# Altium project RT-701_V005.PrjPcb
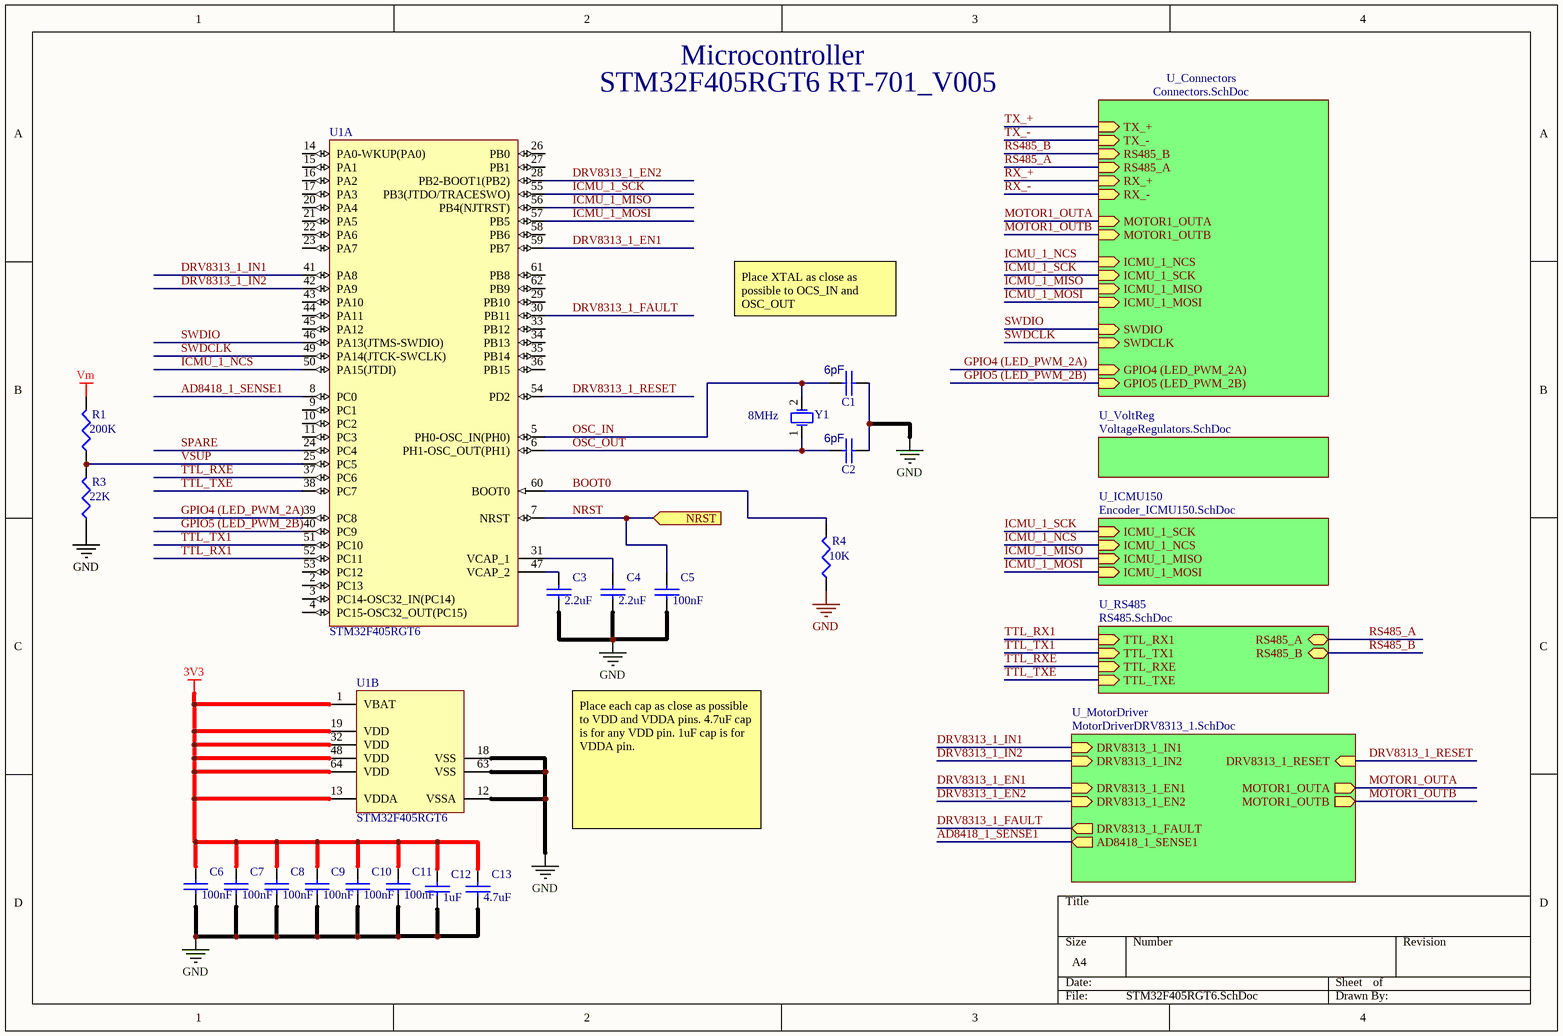
[diagram p0: STM32F405RGT6.SchDoc]
6 sheets, 76 parts. Net scope: hierarchical (ports join the sheet entries above them; power ports are global).
Board file: RT-701_V005.PcbDoc
Sheets:
  STM32F405RGT6.SchDoc
    U_RS485 = RS485.SchDoc
    U_MotorDriver = MotorDriverDRV8313_1.SchDoc
    U_ICMU150 = Encoder_ICMU150.SchDoc
    U_VoltReg = VoltageRegulators.SchDoc
    U_Connectors = Connectors.SchDoc

## Sheet STM32F405RGT6.SchDoc
size A4

### Parts
C1  Capacitance: 6pF  [CAP0402]  (hidden comment: Capacitor)
C2  Capacitance: 6pF  [CAP0402]  (hidden comment: Capacitor)
C3  value 2.2uF  [CAP0402]  (hidden comment: Capacitor)
C4  value 2.2uF  [CAP0402]  (hidden comment: Capacitor)
C5  value 100nF  [CAP0402]  (hidden comment: Capacitor)
C6  value 100nF  [CAP0402]  (hidden comment: Capacitor)
C7  value 100nF  [CAP0402]  (hidden comment: Capacitor)
C8  value 100nF  [CAP0402]  (hidden comment: Capacitor)
C9  value 100nF  [CAP0402]  (hidden comment: Capacitor)
C10  value 100nF  [CAP0402]  (hidden comment: Capacitor)
C11  value 100nF  [CAP0402]  (hidden comment: Capacitor)
C12  value 1uF  [CAP0402]  (hidden comment: Capacitor)
C13  value 4.7uF  [CAP0402]  (hidden comment: Capacitor)
R1  value 200K  [RES0402]  (hidden comment: Res)
R3  value 22K  [RES0402]  (hidden comment: Res)
R4  value 10K  [RES0402]  (hidden comment: Res)
U1  STM32F405RGT6  [STM-LQFP64_N]  (parts A,B of 2)
Y1  value 8MHz  [2-SMD-XTAL (3.2x2.5)]  (hidden comment: Osc)

### Sub-sheets
U_Connectors = Connectors.SchDoc: TX_+ (in), RS485_B (in), RX_+ (in), MOTOR1_OUTA (in), MOTOR1_OUTB (in), TX_- (in), RS485_A (in), RX_- (in), ICMU_1_NCS (in), ICMU_1_SCK (in), ICMU_1_MISO (in), ICMU_1_MOSI (in), SWDIO (in), SWDCLK (in), GPIO4 (LED_PWM_2A) (in), GPIO5 (LED_PWM_2B) (in)
U_ICMU150 = Encoder_ICMU150.SchDoc: ICMU_1_SCK (in), ICMU_1_NCS (in), ICMU_1_MISO (in), ICMU_1_MOSI (in)
U_MotorDriver = MotorDriverDRV8313_1.SchDoc: DRV8313_1_IN1 (in), DRV8313_1_IN2 (in), DRV8313_1_EN1 (in), DRV8313_1_EN2 (in), MOTOR1_OUTA (out), MOTOR1_OUTB (out), DRV8313_1_RESET (in), DRV8313_1_FAULT (out), AD8418_1_SENSE1 (out)
U_RS485 = RS485.SchDoc: TTL_RX1 (in), TTL_TX1 (in), TTL_RXE (in), TTL_TXE (in), RS485_A (bidir), RS485_B (bidir)
U_VoltReg = VoltageRegulators.SchDoc: no entries

### Ports
NRST (in)

### Nets
3V3: C6.1 C7.1 C8.1 C9.1 C10.1 C11.1 C12.1 C13.1 U1.1(VBAT) U1.13(VDDA) U1.19(VDD) U1.32(VDD) U1.48(VDD) U1.64(VDD)
GND: C1.1 C2.1 C3.2 C4.2 C5.2 C6.2 C7.2 C8.2 C9.2 C10.2 C11.2 C12.2 C13.2 R3.1 R4.1 U1.12(VSSA) U1.18(VSS) U1.63(VSS)
Vm: R1.2
AD8418_1_SENSE1: U1.8(PC0) ; sheet U_MotorDriver/AD8418_1_SENSE1
BOOT0: R4.2 U1.60(BOOT0)
DRV8313_1_EN1: U1.59(PB7) ; sheet U_MotorDriver/DRV8313_1_EN1
DRV8313_1_EN2: U1.28(PB2-BOOT1(PB2)) ; sheet U_MotorDriver/DRV8313_1_EN2
DRV8313_1_FAULT: U1.30(PB11) ; sheet U_MotorDriver/DRV8313_1_FAULT
DRV8313_1_IN1: U1.41(PA8) ; sheet U_MotorDriver/DRV8313_1_IN1
DRV8313_1_IN2: U1.42(PA9) ; sheet U_MotorDriver/DRV8313_1_IN2
DRV8313_1_RESET: U1.54(PD2) ; sheet U_MotorDriver/DRV8313_1_RESET
GPIO4 (LED_PWM_2A): U1.39(PC8) ; sheet U_Connectors/GPIO4 (LED_PWM_2A)
GPIO5 (LED_PWM_2B): U1.40(PC9) ; sheet U_Connectors/GPIO5 (LED_PWM_2B)
ICMU_1_MISO: U1.56(PB4(NJTRST)) ; sheet U_ICMU150/ICMU_1_MISO, sheet U_Connectors/ICMU_1_MISO
ICMU_1_MOSI: U1.57(PB5) ; sheet U_ICMU150/ICMU_1_MOSI, sheet U_Connectors/ICMU_1_MOSI
ICMU_1_NCS: U1.50(PA15(JTDI)) ; sheet U_ICMU150/ICMU_1_NCS, sheet U_Connectors/ICMU_1_NCS
ICMU_1_SCK: U1.55(PB3(JTDO/TRACESWO)) ; sheet U_ICMU150/ICMU_1_SCK, sheet U_Connectors/ICMU_1_SCK
MOTOR1_OUTA: sheet U_MotorDriver/MOTOR1_OUTA, sheet U_Connectors/MOTOR1_OUTA
MOTOR1_OUTB: sheet U_MotorDriver/MOTOR1_OUTB, sheet U_Connectors/MOTOR1_OUTB
NRST: C5.1 U1.7(NRST) ; port NRST
OSC_IN: C1.2 U1.5(PH0-OSC_IN(PH0)) Y1.2
OSC_OUT: C2.2 U1.6(PH1-OSC_OUT(PH1)) Y1.1
RS485_A: sheet U_RS485/RS485_A, sheet U_Connectors/RS485_A
RS485_B: sheet U_RS485/RS485_B, sheet U_Connectors/RS485_B
SPARE: U1.24(PC4)
SWDCLK: U1.49(PA14(JTCK-SWCLK)) ; sheet U_Connectors/SWDCLK
SWDIO: U1.46(PA13(JTMS-SWDIO)) ; sheet U_Connectors/SWDIO
TTL_RX1: U1.52(PC11) ; sheet U_RS485/TTL_RX1
TTL_RXE: U1.37(PC6) ; sheet U_RS485/TTL_RXE
TTL_TX1: U1.51(PC10) ; sheet U_RS485/TTL_TX1
TTL_TXE: U1.38(PC7) ; sheet U_RS485/TTL_TXE
VSUP: R1.1 R3.2 U1.25(PC5)
NetC3_1: C3.1 U1.47(VCAP_2)
NetC4_1: C4.1 U1.31(VCAP_1)

Not connected (* = marked no-connect by the designer): U1 2(PC13) 3(PC14-OSC32_IN(PC14)) 4(PC15-OSC32_OUT(PC15)) 9(PC1) 10(PC2) 11(PC3) 14(PA0-WKUP(PA0)) 15(PA1) 16(PA2) 17(PA3) 20(PA4) 21(PA5) 22(PA6) 23(PA7) 26(PB0) 27(PB1) 29(PB10) 33(PB12) 34(PB13) 35(PB14) 36(PB15) 43(PA10) 44(PA11) 45(PA12) 53(PC12) 58(PB6) 61(PB8) 62(PB9)

### Notes on the sheet
- STM32F405RGT6 RT-701_V005
- Microcontroller
- Place XTAL as close as possible to OCS_IN and OSC_OUT
- Place each cap as close as possible to VDD and VDDA pins. 4.7uF cap is for any VDD pin. 1uF cap is for VDDA pin.

### Library data of the parts
C1 C2 = Capacitor: CAP CER 6PF 100V C0G/NP0 0402; Manufacturer 1: KEMET; Manufacturer Part Number 1: CBR04C609B1GAC; Manufacturer: *; Manufacturer Part Number: *; Supplier: *; Supplier Part Number: *; Tolerance: *; Voltage: *; Footprint: *; Temperature Coefficient: *; Supplier 1: Digi-Key; Supplier Part Number 1: 399-8610-1-ND; RoHS: Yes; Category: Ceramic Capacitors; Stock 1: 20446; Pricing 1: 1=0,34000, 10=0,23300, 50=0,15540, 100=0,13200, 500=0,09320, 1000=0,08154, 2500=0,07766, 5000=0,07184 (USD); Mount: Surface Mount; Case/Package: 0402; Case Code (Metric): 1005; Case Code (Imperial): 0402; Min Operating Temperature: -55°C; Max Operating Temperature: 125°C; Package Quantity: 1; Voltage Rating: 100V; Packaging: Tape and Reel; Voltage Rating (DC): 100V; Series: CBR; Length: 0.039inch; Width: 0.02inch; Thickness: 0.022inch; RoHS Compliant: Yes; ComponentLink1URL: https://datasheet.ciiva.com/6257/kem-c1030-cbr-smd-6257478.pdf?src-supplier=Digi-Key; ComponentLink1Description: https://datasheet.ciiva.com/6257/kem-c1030-cbr-smd-6257478.pdf?src-supplier=Digi-Key; ComponentLink2URL: https://datasheet.ciiva.com/6257/kem-c1030-cbr-smd-6257482.pdf?src-supplier=Digi-Key; ComponentLink2Description: https://datasheet.ciiva.com/6257/kem-c1030-cbr-smd-6257482.pdf?src-supplier=Digi-Key
C3 C4 = Capacitor: Manufacturer: TDK Corporation; Manufacturer Part Number: C1005X5R0J225K050BC; Tolerance: 10%; Voltage: 6.3V; Temperature Coefficient: X5R; Supplier: Digikey; Supplier Part Number: 445-6847-1-ND; Footprint: 0402; Component Type: Capacitor Ceramic
C5-C11 = Capacitor: Manufacturer: TDK Corporation; Manufacturer Part Number: CGA2B3X7R1V104K050BB; Tolerance: 10%; Voltage: 35V; Temperature Coefficient: X7R; Supplier: Digi-Key; Supplier Part Number: 445-6901-1-ND; Footprint: 0201 (0603 Metric); Component Type: Capacitor Ceramic; Price: 0.21
C12 = Capacitor: Manufacturer: TDK Corporation; Manufacturer Part Number: C1005X5R1V105K050BC; Tolerance: 10%; Voltage: 35V; Temperature Coefficient: X5R; Supplier: Digikey; Supplier Part Number: 445-9073-1-ND; Footprint: 0201 (0603 Metric); Component Type: Capacitor Ceramic
C13 = Capacitor: Manufacturer: TDK Corporation; Manufacturer Part Number: C1005X5R0J475K050BC; Tolerance: 10%; Voltage: 6.3V; Supplier: Digikey; Supplier Part Number: 445-5947-1-ND; Footprint: 0201 (0603 Metric); Component Type: Capacitor Ceramic; Price: 0.6
R1 = Resistor: Manufacturer: Yageo; Manufacturer Part Number: RC0402FR-07200KL; Power Rating: 0.063W; Tolerance: 1%; Component Type: Resistor; Price: 0.14; Supplier: Digi-Key; Supplier Part Number: 311-200KLRCT-ND; Footprint: 0201 (0603 Metric)
R3 = Resistor: Manufacturer: Yageo; Manufacturer Part Number: RC0402FR-0722KL; Power Rating: 0.063W; Tolerance: 1%; Component Type: Resistor; Price: 0.14; Supplier: Digikey; Supplier Part Number: 311-22.0KLRCT-ND
R4 = Resistor: Manufacturer: Yageo; Manufacturer Part Number: RC0402FR-0710KL; Power Rating: 0.063W; Tolerance: 1%; Component Type: Resistor; Price: 0.14; Supplier: Digi-Key; Supplier Part Number: 311-10.0KLRCT-ND; Footprint: 0201 (0603 Metric)
U1 = STM32F405RGT6: ARM Cortex-M4 32-bit MCU+FPU, 210 DMIPS, 1024 kB Flash, 192 kB Internal RAM, 51 I/Os, 64-pin LQFP, -40 to 85 degC, Tray; Manufacturer: STMicroelectronics; Component Type: ARM® Cortex®-M4 STM32 F4 Microcontroller IC 32-Bit 168MHz 1MB (1M x 8) FLASH 64-LQFP (10x10); Manufacturer Part Number: STM32F405RGT6; Price: 14.74; Supplier: Digi-Key; Supplier Part Number: 497-11767-ND
Y1 = Crystal Oscillator: Manufacturer: NDK; Manufacturer Part Number: NX3225GD-8MHZ-STD-CRA-3; Component Type: Crystal Oscillator; Price: 0.94; Supplier: Digi-Key; Supplier Part Number: 644-1178-1-ND

## Sheet RS485.SchDoc
size A4
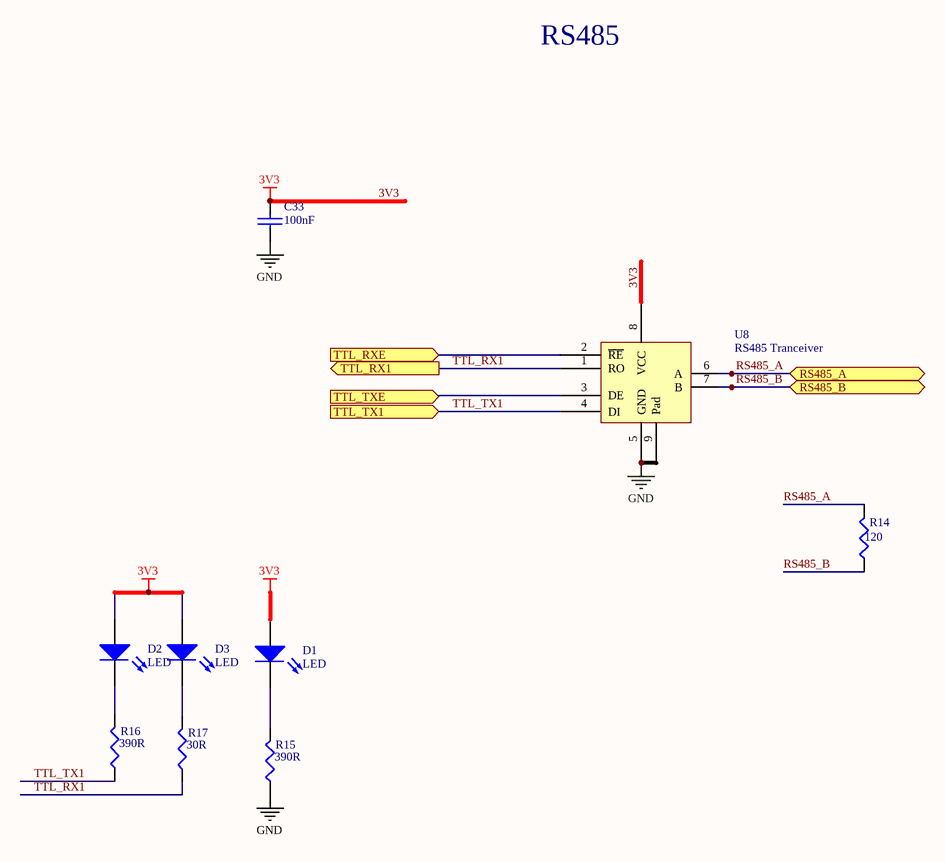
[diagram p1: RS485.SchDoc]

### Parts
C33  value 100nF  [CAP0402]  (hidden comment: Capacitor)
D1  LED  [LED-0603-RED]
D2  LED  [LED-0603-YELLOW]
D3  LED  [LED-0603-GREEN]
R14  value 120  [RES1206]  (hidden comment: Res)
R15  value 390R  [RES0402]  (hidden comment: Res)
R16  value 390R  [RES0402]  (hidden comment: Res)
R17  value 30R  [RES0402]  (hidden comment: Res)
U8  RS485 Tranceiver  [MAX22501EATA+]

### Ports
RS485_A (bidir), RS485_B (bidir), TTL_RX1 (out), TTL_RXE (in), TTL_TX1 (in), TTL_TXE (in)

### Nets
3V3: C33.1 D1.2 D2.2 D3.2 U8.8(VCC)
GND: C33.2 R15.1 U8.5(GND) U8.9(Pad)
RS485_A: R14.2 U8.6(A) ; port RS485_A
RS485_B: R14.1 U8.7(B) ; port RS485_B
TTL_RX1: R17.1 U8.1(RO) ; port TTL_RX1
TTL_RXE: U8.2(~{RE}) ; port TTL_RXE
TTL_TX1: R16.1 U8.4(DI) ; port TTL_TX1
TTL_TXE: U8.3(DE) ; port TTL_TXE
NetD1_1: D1.1 R15.2
NetD2_1: D2.1 R16.2
NetD3_1: D3.1 R17.2

### Notes on the sheet
- RS485

### Library data of the parts
C33 = Capacitor: as C5 on sheet STM32F405RGT6; Supplier: Digi-Key; Supplier Part Number: 445-6901-1-ND; Footprint: 0402 (1005 Metric); Component Type: Capacitor Ceramic; Price: 0.21
D1 = LED: Manufacturer: Wurth Electronics Inc.; Manufacturer Part Number: 150060RS75000; Colour: Red; Component Type: Red 625nm LED Indication - Discrete 2V 0603 (1608 Metric); Price: 0.39; Supplier: Digi-Key; Supplier Part Number: 732-4978-1-ND
D2 = LED: Manufacturer: Wurth Electronics Inc.; Manufacturer Part Number: 150060YS75000; Colour: Yellow; Component Type: Yellow 590nm LED Indication - Discrete 2V 0603 (1608 Metric); Price: 0.39; Supplier: Digi-Key; Supplier Part Number: 732-4981-1-ND
D3 = LED: Manufacturer: Wurth Electronics Inc.; Manufacturer Part Number: 150060GS75000; Colour: Green; Component Type: Green 520nm LED Indication - Discrete 3.2V 0603 (1608 Metric); Price: 0.39; Supplier: Digi-Key; Supplier Part Number: 732-4971-1-ND
R14 = Resistor: Component Type: Resistor
R15 R16 = Resistor: Manufacturer: Yageo; Manufacturer Part Number: RC0402FR-07390RL; Power Rating: 0.063W; Tolerance: 1%; Component Type: Resistor; Price: 0.14; Supplier: Digi-Key; Supplier Part Number: 311-390LRCT-ND; Footprint: 0201 (0603 Metric)
R17 = Resistor: Manufacturer: Yageo; Manufacturer Part Number: RC0402FR-0730RL; Power Rating: 0.063W; Tolerance: 1%; Component Type: Resistor; Price: 0.14; Supplier: Digi-Key; Supplier Part Number: 311-30LRCT-ND; Footprint: 0201 (0603 Metric)
U8 = MAX22501EATA+: Manufacturer: Maxim Integrated; Price: 2.91; Supplier Part Number: MAX22501EATA+-ND; Manufacturer Part Number: MAX22501EATA+; Component Type: 1/1 Transceiver Half RS422, RS485 8-TDFN (3x3); Supplier: Digi-Key

## Sheet MotorDriverDRV8313_1.SchDoc
size A4
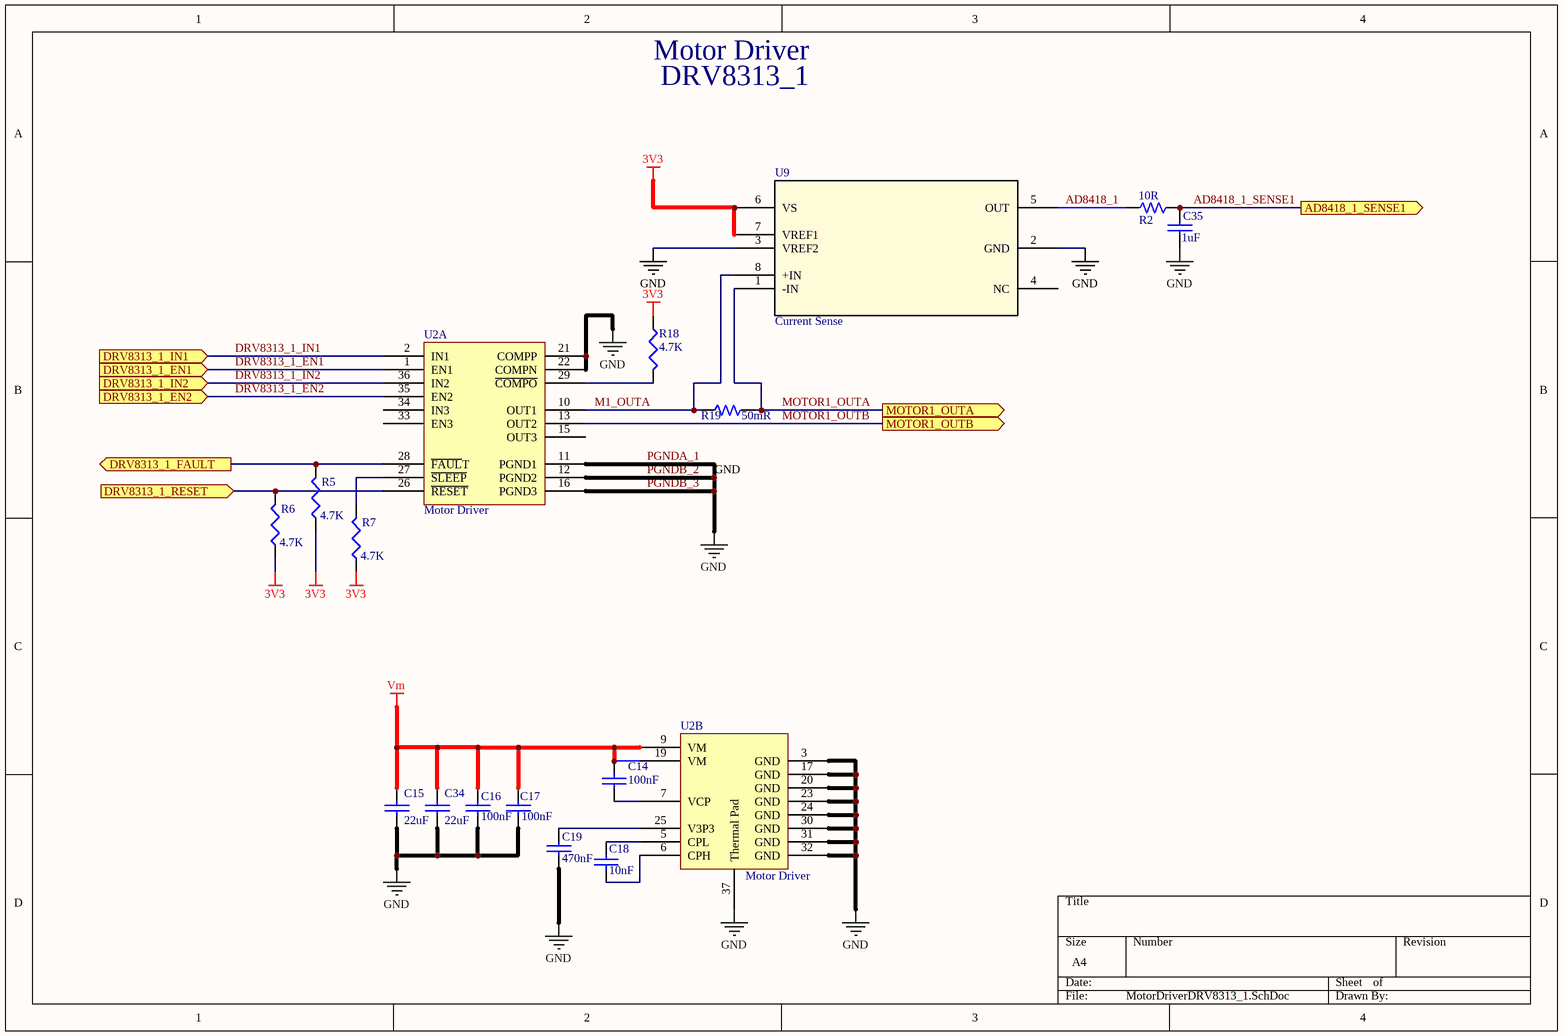
[diagram p2: MotorDriverDRV8313_1.SchDoc]

### Parts
C14  value 100nF  [CAP0402]  (hidden comment: Capacitor)
C15  value 22uF  [CAP0805]  (hidden comment: Capacitor)
C16  value 100nF  [CAP0402]  (hidden comment: Capacitor)
C17  value 100nF  [CAP0402]  (hidden comment: Capacitor)
C18  value 10nF  [CAP0402]  (hidden comment: Capacitor)
C19  value 470nF  [CAP0402]  (hidden comment: Capacitor)
C34  value 22uF  [CAP0805]  (hidden comment: Capacitor)
C35  value 1uF  [CAP0402]  (hidden comment: Capacitor)
R2  Resistance: 10R  [RES0402]  (hidden comment: Resistor)
R5  value 4.7K  [RES0402]  (hidden comment: Res)
R6  value 4.7K  [RES0402]  (hidden comment: Res)
R7  value 4.7K  [RES0402]  (hidden comment: Res)
R18  value 4.7K  [RES0402]  (hidden comment: Res)
R19  Resistance: 50mR  [RES0805]  (hidden comment: Resistor)
U2  Motor Driver  [DRV8313RHHR]  (parts A,B of 2)
U9  Current Sense  [AD8418BRMZ]

### Ports
AD8418_1_SENSE1 (out), DRV8313_1_EN1 (in), DRV8313_1_EN2 (in), DRV8313_1_FAULT (out), DRV8313_1_IN1 (in), DRV8313_1_IN2 (in), DRV8313_1_RESET (in), MOTOR1_OUTA (out), MOTOR1_OUTB (out)

### Nets
3V3: R5.1 R6.1 R7.1 R18.1 U9.6(VS) U9.7(VREF1)
GND: C15.2 C16.2 C17.2 C19.2 C34.2 C35.2 U2.3(GND) U2.11(PGND1) U2.12(PGND2) U2.16(PGND3) U2.17(GND) U2.20(GND) U2.21(COMPP) U2.22(COMPN) U2.23(GND) U2.24(GND) U2.30(GND) U2.31(GND) U2.32(GND) U2.37(Thermal_Pad) U9.2(GND) U9.3(VREF2)  [also labelled PGNDA_1, PGNDB_2, PGNDB_3]
Vm: C14.1 C15.1 C16.1 C17.1 C34.1 U2.9(VM) U2.19(VM)
AD8418_1: R2.1 U9.5(OUT)
AD8418_1_SENSE1: C35.1 R2.2 ; port AD8418_1_SENSE1
DRV8313_1_EN1: U2.1(EN1) ; port DRV8313_1_EN1
DRV8313_1_EN2: U2.35(EN2) ; port DRV8313_1_EN2
DRV8313_1_FAULT: R5.2 U2.28(~{FAUL}T) ; port DRV8313_1_FAULT
DRV8313_1_IN1: U2.2(IN1) ; port DRV8313_1_IN1
DRV8313_1_IN2: U2.36(IN2) ; port DRV8313_1_IN2
DRV8313_1_RESET: R6.2 U2.26(~{RESET}) ; port DRV8313_1_RESET
M1_OUTA: R19.1 U2.10(OUT1) U9.8(+IN)
MOTOR1_OUTA: R19.2 U9.1(-IN) ; port MOTOR1_OUTA
MOTOR1_OUTB: U2.13(OUT2) ; port MOTOR1_OUTB
NetC14_2: C14.2 U2.7(VCP)
NetC18_1: C18.1 U2.5(CPL)
NetC18_2: C18.2 U2.6(CPH)
NetC19_1: C19.1 U2.25(V3P3)
NetR7_2: R7.2 U2.27(~{SLEEP})
NetR18_2: R18.2 U2.29(~{COMPO})

Not connected (* = marked no-connect by the designer): U2 15(OUT3) 33(EN3) 34(IN3); U9 4(NC)

### Notes on the sheet
- Motor Driver
- DRV8313_1

### Library data of the parts
C14 C16 C17 = Capacitor: as C5 on sheet STM32F405RGT6; Supplier: Digi-Key; Supplier Part Number: 445-6901-1-ND; Footprint: 0201 (0603 Metric); Component Type: Capacitor Ceramic; Price: 0.21
C15 C34 = Capacitor: Manufacturer: TDK Corporation; Manufacturer Part Number: C2012JB1V226M125AC; Tolerance: 20%; Voltage: 35V; Supplier: Digikey; Supplier Part Number: 445-11527-1-ND; Footprint: 0805; Component Type: Capacitor Ceramic; Price: 1.49
C18 = Capacitor: Manufacturer: TDK Corporation; Manufacturer Part Number: C1005X7R1V103K050BB; Tolerance: 10%; Voltage: 35V; Temperature Coefficient: X7R; Supplier: Digi-Key; Supplier Part Number: 445-7338-1-ND; Footprint: 0201 (0603 Metric); Component Type: Capacitor Ceramic; Price: 0.14
C19 = Capacitor: Manufacturer: Murata Electronics North America; Manufacturer Part Number: GRM155R61A474KE15D; Tolerance: 10%; Voltage: 10V; Temperature Coefficient: X5R; Supplier: Digi-Key; Supplier Part Number: 490-3264-1-ND; Footprint: 0201 (0603 Metric); Component Type: Capacitor Ceramic; Price: 0.140
C35 = Capacitor: as C12 on sheet STM32F405RGT6; Supplier: Digikey; Supplier Part Number: 445-9073-1-ND; Footprint: 0402 (1005 Metric); Component Type: Capacitor Ceramic
R2 = Resistor: Manufacturer 1: Panasonic; Manufacturer Part Number 1: ERJ-2RKF10R0X; Voltage Rating (DC): 50V; Max Power Dissipation: 100mW; Tolerance: 1%; Temperature Coefficient: 100ppm/°C; Supplier 1: Digi-Key; Supplier Part Number 1: P10.0LCT-ND; Stock 1: 6121248; Pricing 1: 1=0,10000, 10=0,04800, 100=0,01960, 1000=0,00882, 2500=0,00766, 5000=0,00633 (USD); RoHS: Yes; Mount: Surface Mount; Case/Package: 0402; Number of Pins: 2; Case Code (Imperial): 0402; Case Code (Metric): 1005; Contact Plating: Tin; Min Operating Temperature: -55°C; Max Operating Temperature: 155°C; Features: Automotive AEC-Q200; Power Rating: 100mW; Termination: SMD/SMT; Composition: Thick Film; Voltage Rating: 50V; Number of Terminations: 2; Packaging: Tape and Reel; Military Standard: Not; Package Quantity: 1; Length: 1mm; Height: 0.35mm; Depth: 0.5mm; Width: 0.5mm; Radiation Hardening: No; Lead Free: Lead Free; REACH SVHC: No SVHC; ComponentLink1URL: https://datasheet.ciiva.com/11821/0900766b80f80784-11821168.pdf?src-supplier=RSComponents; ComponentLink1Description: https://datasheet.ciiva.com/11821/0900766b80f80784-11821168.pdf?src-supplier=RSComponents; ComponentLink2URL: https://datasheet.ciiva.com/7802/aoa0000ce2-7802405.pdf?src-supplier=Element14; ComponentLink2Description: https://datasheet.ciiva.com/7802/aoa0000ce2-7802405.pdf?src-supplier=Element14; ComponentLink3URL: https://datasheet.ciiva.com/43467/1678782-43467127.pdf?src-supplier=Farnell; ComponentLink3Description: https://datasheet.ciiva.com/43467/1678782-43467127.pdf?src-supplier=Farnell; ComponentLink4URL: https://datasheet.ciiva.com/22668/1678782-22668302.pdf?src-supplier=Element14; ComponentLink4Description: https://datasheet.ciiva.com/22668/1678782-22668302.pdf?src-supplier=Element14; ComponentLink5URL: https://datasheet.ciiva.com/16773/70260748-16773366.pdf?src-supplier=Allied+Electronics; ComponentLink5Description: https://datasheet.ciiva.com/16773/70260748-16773366.pdf?src-supplier=Allied+Electronics; ComponentLink6URL: https://datasheet.ciiva.com/9194/aoa0000ce2-9194120.pdf?src-supplier=Avnet; ComponentLink6Description: https://datasheet.ciiva.com/9194/aoa0000ce2-9194120.pdf?src-supplier=Avnet; ComponentLink7URL: https://datasheet.ciiva.com/30218/aoa0000ce2-30218536.pdf?src-supplier=Onlinecomponents.com; ComponentLink7Description: https://datasheet.ciiva.com/30218/aoa0000ce2-30218536.pdf?src-supplier=Onlinecomponents.com; ComponentLink8URL: https://datasheet.ciiva.com/17212/aoa0000ce2-17212057.pdf?src-supplier=Avnet+Europe; ComponentLink8Description: https://datasheet.ciiva.com/17212/aoa0000ce2-17212057.pdf?src-supplier=Avnet+Europe; ComponentLink9URL: https://datasheet.ciiva.com/24071/aoa0000ce2-24071514.pdf?src-supplier=Mouser; ComponentLink9Description: https://datasheet.ciiva.com/24071/aoa0000ce2-24071514.pdf?src-supplier=Mouser; ComponentLink10URL: https://datasheet.ciiva.com/27055/1987054-27055644.pdf?src-supplier=Jameco; ComponentLink10Description: https://datasheet.ciiva.com/27055/1987054-27055644.pdf?src-supplier=Jameco; ComponentLink11URL: https://datasheet.ciiva.com/6082/aoa0000ce2-6082046.pdf?src-supplier=Farnell; ComponentLink11Description: https://datasheet.ciiva.com/6082/aoa0000ce2-6082046.pdf?src-supplier=Farnell
R5-R7 R18 = Resistor: Manufacturer: Yageo; Manufacturer Part Number: RC0402JR-074K7L; Power Rating: 0.063W; Tolerance: 5%; Component Type: Resistor; Price: 0.14; Supplier: Digikey; Supplier Part Number: 311-4.7KJRCT-ND; Footprint: 0402
R19 = Resistor: Manufacturer 1: Bourns; Manufacturer Part Number 1: CRM0805-FW-R050ELF; Power Rating: 250mW; Tolerance: 1%; Voltage Rating: 477mV; Temperature Coefficient: 200ppm/°C; Supplier 1: Digi-Key; Supplier Part Number 1: CRM0805-FW-R050ELFCT-ND; Stock 1: 43412; Pricing 1: 1=0,65000, 10=0,48200, 25=0,39120, 50=0,34020, 100=0,28070, 250=0,24384, 500=0,19846, 1000=0,15741 (USD); RoHS: Yes; Case/Package: 0805; Number of Pins: 2; Case Code (Imperial): 0805; Case Code (Metric): 2012; Min Operating Temperature: -55°C; Max Operating Temperature: 155°C; Composition: Thick Film; Number of Terminations: 2; Packaging: Tape and Reel; Package Quantity: 1; Max Power Dissipation: 250mW; Length: 0.079inch; Height: 0.024inch; Width: 0.047inch; REACH SVHC: No SVHC; ComponentLink1URL: https://datasheet.ciiva.com/22693/1859481-22693285.pdf?src-supplier=Element14; ComponentLink1Description: https://datasheet.ciiva.com/22693/1859481-22693285.pdf?src-supplier=Element14; ComponentLink2URL: https://datasheet.ciiva.com/6564/crm0805-1206-2010-6564006.pdf?src-supplier=Digi-Key; ComponentLink2Description: https://datasheet.ciiva.com/6564/crm0805-1206-2010-6564006.pdf?src-supplier=Digi-Key; ComponentLink3URL: https://datasheet.ciiva.com/6564/crm0805-1206-2010-6564007.pdf?src-supplier=Digi-Key; ComponentLink3Description: https://datasheet.ciiva.com/6564/crm0805-1206-2010-6564007.pdf?src-supplier=Digi-Key; ComponentLink4URL: https://datasheet.ciiva.com/6564/crm0805-1206-2010-6564008.pdf?src-supplier=Digi-Key; ComponentLink4Description: https://datasheet.ciiva.com/6564/crm0805-1206-2010-6564008.pdf?src-supplier=Digi-Key; ComponentLink5URL: https://datasheet.ciiva.com/7985/1859481-7985934.pdf?src-supplier=Element14; ComponentLink5Description: https://datasheet.ciiva.com/7985/1859481-7985934.pdf?src-supplier=Element14
U2 = DRV8313RHHR: 2.5A 3-phase BLDC controller; Manufacturer: Texas Instruments; Component Type: Motor Driver Power MOSFET; Manufacturer Part Number: DRV8313RHHR; Price: 5.08; Supplier: Digi-Key; Supplier Part Number: 296-44591-1-ND
U9 = AD8418BRMZ: Imported; Manufacturer: Analog Devices Inc; Component Type: Current Sense Amplifier 1 Circuit 8-MSOP; Manufacturer Part Number: AD8418BRMZ; Supplier: Digi-Key; Supplier Part Number: AD8418BRMZ-ND; Price: 3.50

## Sheet Encoder_ICMU150.SchDoc
size A4
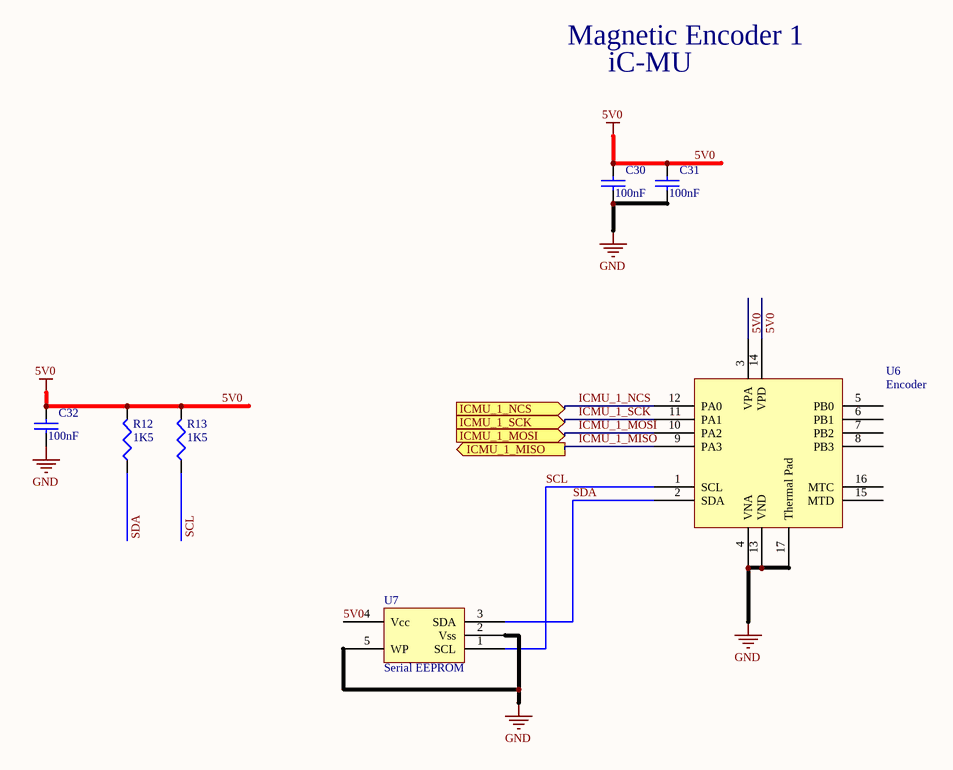
[diagram p3: Encoder_ICMU150.SchDoc]

### Parts
C30  value 100nF  [CAP0402]  (hidden comment: Capacitor)
C31  value 100nF  [CAP0402]  (hidden comment: Capacitor)
C32  value 100nF  [CAP0402]  (hidden comment: Capacitor)
R12  value 1K5  [RES0402]  (hidden comment: Res)
R13  value 1K5  [RES0402]  (hidden comment: Res)
U6  Encoder  [iC-MU RevC2]
U7  Serial EEPROM  [SOT23-5]

### Ports
ICMU_1_MISO (out), ICMU_1_MOSI (in), ICMU_1_NCS (in), ICMU_1_SCK (in)

### Nets
5V0: C30.1 C31.1 C32.1 R12.2 R13.2 U6.3(VPA) U6.14(VPD) U7.4(Vcc)
GND: C30.2 C31.2 C32.2 U6.4(VNA) U6.13(VND) U6.17(Thermal_Pad) U7.2(Vss) U7.5(WP)
ICMU_1_MISO: U6.9(PA3) ; port ICMU_1_MISO
ICMU_1_MOSI: U6.10(PA2) ; port ICMU_1_MOSI
ICMU_1_NCS: U6.12(PA0) ; port ICMU_1_NCS
ICMU_1_SCK: U6.11(PA1) ; port ICMU_1_SCK
SCL: R13.1 U6.1(SCL) U7.1(SCL)
SDA: R12.1 U6.2(SDA) U7.3(SDA)

Not connected (* = marked no-connect by the designer): U6 5(PB0) 6(PB1) 7(PB2) 8(PB3) 15(MTD) 16(MTC)

### Notes on the sheet
- Magnetic Encoder 1
- iC-MU

### Library data of the parts
C30-C32 = Capacitor: Manufacturer: TDK Corporation; Manufacturer Part Number: CGA2B3X7R1V104K050BB; Voltage: 35V; Supplier: Digi-Key; Supplier Part Number: 445-6901-1-ND; Tolerance: *; Footprint: 0402; Component Type: Capacitor Ceramic
R12 R13 = Resistor: Manufacturer: Yageo; Manufacturer Part Number: RC0402FR-071K5L; Component Type: Resistor; Supplier: Digi-Key; Supplier Part Number: 311-1.50KLRCT-ND; Power Rating: *; Footprint: 0402; Tolerance: *
U6 = IC-MU DFN16-5x5: Off Axis Encoder with Hall Sensors; Manufacturer: iC-Haus; Manufacturer Part Number: IC-MU150DFN16-5X5; Component Type: Magnetic Off-Axis Absolute Position Encoder - pole width 1.50 mm; Supplier: Symmetry Electronics; Supplier Part Number: IC-MU150DFN16-5X5
U7 = 24AA02T-I/OT: 2K I2C Serial EEPROM; Manufacturer: Microchip Technology; Footprint: SOT-23-5; Price: 0.28; Supplier: Digi-Key; Supplier Part Number: 24AA02T-I/OTCT-ND; Component Type: IC EEPROM 2KBIT 400KHZ SOT23-5; Manufacturer Part Number: 24AA02T-I/OT

## Sheet VoltageRegulators.SchDoc
size A4
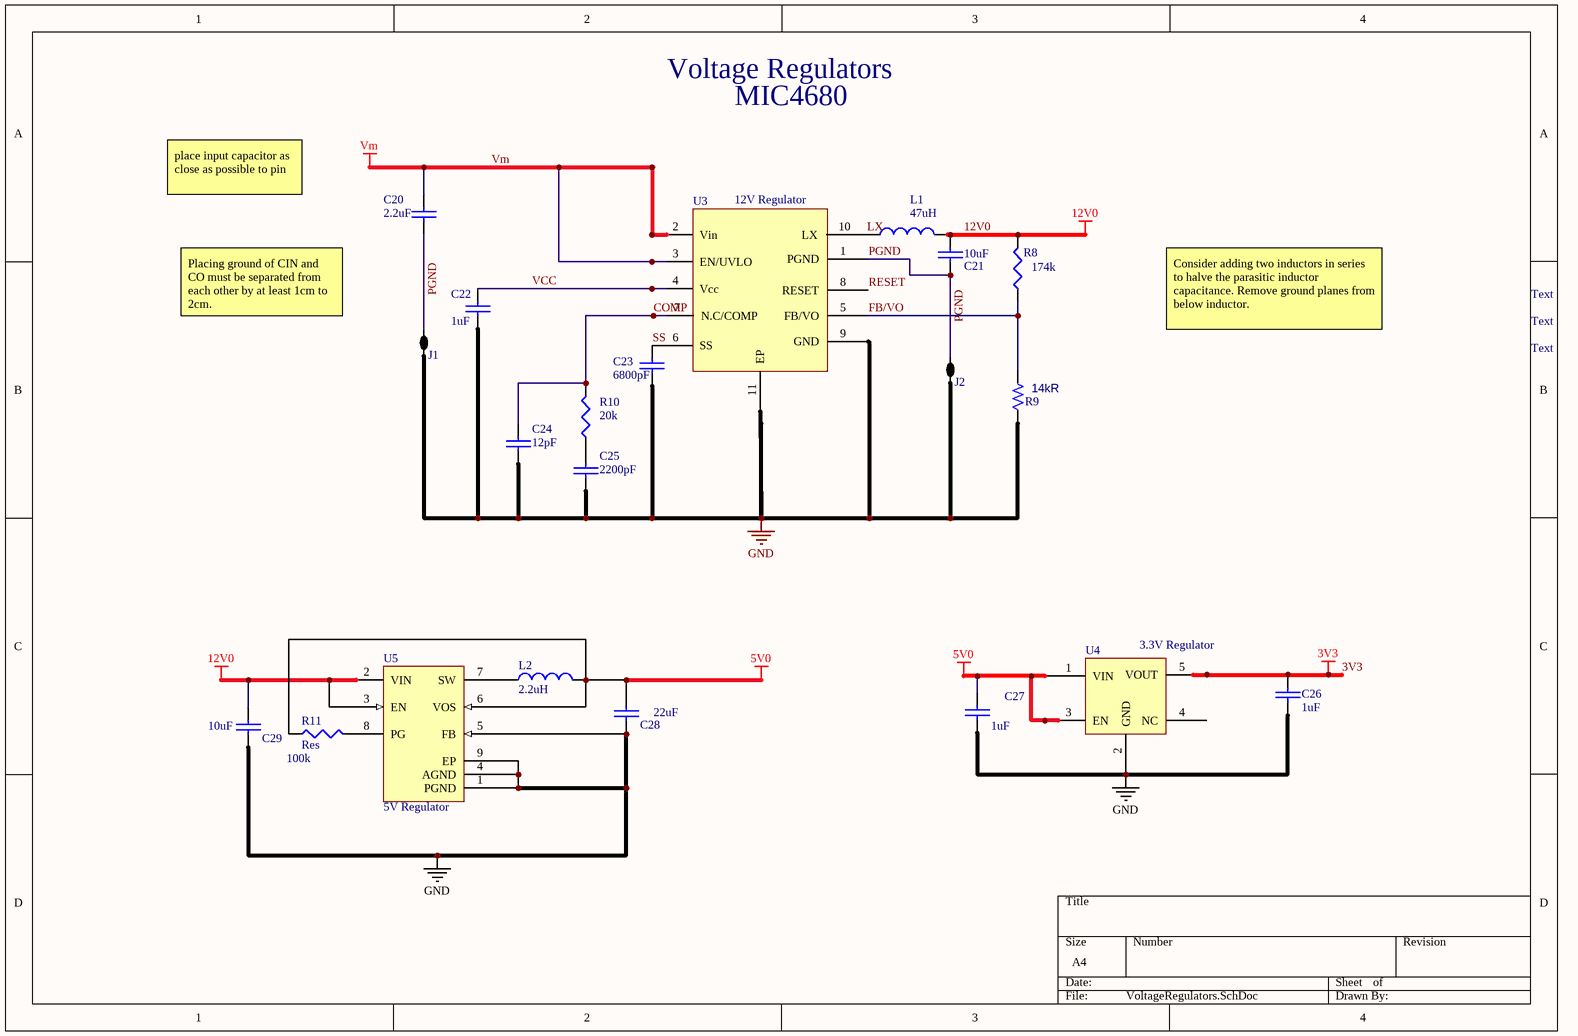
[diagram p4: VoltageRegulators.SchDoc]

### Parts
C20  value 2.2uF  [CAP0805]  (hidden comment: Capacitor)
C21  value 10uF  [CAP1210]  (hidden comment: Capacitor)
C22  value 1uF  [CAP0402]  (hidden comment: Capacitor)
C23  value 6800pF  [CAP0402]  (hidden comment: Capacitor)
C24  value 12pF  [CAP0402]  (hidden comment: Capacitor)
C25  value 2200pF  [CAP0402]  (hidden comment: Capacitor)
C26  value 1uF  [CAP0402]  (hidden comment: Capacitor)
C27  value 1uF  [CAP0402]  (hidden comment: Capacitor)
C28  value 22uF  [CAP0805]  (hidden comment: Capacitor)
C29  value 10uF  [CAP0805]  (hidden comment: Capacitor)
J1  2 way net tie junction  [2way_LP]  (value not drawn)  (net tie, no BOM)
J2  2 way net tie junction  [2way_LP]  (value not drawn)  (net tie, no BOM)
L1  value 47uH  [74404064470]  (hidden comment: Inductor)
L2  value 2.2uH  [VLS3012HBX]  (hidden comment: Inductor)
R8  value 174k  [RES0402]  (hidden comment: Res)
R9  Resistance: 14kR  [RES0402]  (hidden comment: Resistor)
R10  value 20k  [RES0402]  (hidden comment: Res)
R11  Res  value 100k  [RES0402]
U3  12V Regulator  [L10 3x2 0.5mm Pitch]
U4  3.3V Regulator  [SOT23-5]
U5  5V Regulator  [DSG8-1600X900TP]

### Nets
3V3: C26.1 U4.5(VOUT)
5V0: C27.1 C28.1 L2.2 R11.1 U4.1(VIN) U4.3(EN) U5.6(VOS)
12V0: C21.1 C29.1 L1.2 R8.2 U5.2(VIN) U5.3(EN)
GND: C22.2 C23.2 C24.2 C25.2 C26.2 C27.2 C28.2 C29.2 J1.1 J2.1 R9.1 U3.9(GND) U3.11(EP) U4.2(GND) U5.1(PGND) U5.4(AGND) U5.5(FB) U5.9(EP)
Vm: C20.1 U3.2(Vin) U3.3(EN/UVLO)
COMP: C24.1 R10.2 U3.7(N.C/COMP)
FB/VO: R8.1 R9.2 U3.5(FB/VO)
LX: L1.1 U3.10(LX)
PGND: C20.2 C21.2 J1.2 J2.2 U3.1(PGND)
RESET: U3.8(RESET)
SS: C23.1 U3.6(SS)
VCC: C22.1 U3.4(Vcc)
NetC25_1: C25.1 R10.1
NetL2_1: L2.1 U5.7(SW)
NetR11_2: R11.2 U5.8(PG)

Not connected (* = marked no-connect by the designer): U4 4(NC)

### Notes on the sheet
- Voltage Regulators
- MIC4680
- place input capacitor as close as possible to pin
- Placing ground of CIN and CO must be separated from each other by at least 1cm to 2cm.
- Text
- Consider adding two inductors in series to halve the parasitic inductor capacitance. Remove ground planes from below inductor.

### Library data of the parts
C20 = Capacitor: Manufacturer: TDK Corporation; Manufacturer Part Number: C2012X7R1V225K085AC; Tolerance: 10%; Voltage: 35V; Temperature Coefficient: X7R; Supplier: Digikey; Supplier Part Number: 445-14547-1-ND; Footprint: 0805; Component Type: Capacitor Ceramic
C21 = Capacitor: Manufacturer: KEMET; Manufacturer Part Number: C1210C106K9RAC7800; Tolerance: 10%; Voltage: 6.3V; Temperature Coefficient: X7R; Supplier: Digikey; Supplier Part Number: 399-13220-1-ND; Footprint: 1210; Component Type: Capacitor Ceramic; Price: 1.39
C22 C26 C27 = Capacitor: as C12 on sheet STM32F405RGT6; Supplier: Digikey; Component Type: Capacitor Ceramic
  C22: Supplier Part Number: 445-9073-1-ND; Footprint: 0201
  C26 C27: Supplier Part Number: 1276-6795-1-ND; Footprint: 0201 (0603 Metric)
C23 = Capacitor: Manufacturer: KEMET; Manufacturer Part Number: C0402C682J5RACTU; Tolerance: 10%; Voltage: 50V; Temperature Coefficient: X7R; Supplier: Digi-Key; Supplier Part Number: 399-8975-1-ND; Footprint: 0402; Component Type: Capacitor Ceramic; Price: 0.13
C24 = Capacitor: Manufacturer: KEMET; Manufacturer Part Number: C0402C120J3GACAUTO; Tolerance: 5%; Voltage: 25; Supplier: digikey; Supplier Part Number: 399-6829-1-ND; Footprint: 0402; Component Type: Capacitor Ceramic; Price: 0.41; Temperature Coefficient: *
C25 = Capacitor: Manufacturer: Murata Electronics North America; Manufacturer Part Number: GRM155R71H222KA01D; Tolerance: 10%; Voltage: 50V; Temperature Coefficient: X7R; Supplier: Digi-Key; Supplier Part Number: 490-1305-1-ND; Footprint: 0402; Component Type: Capacitor Ceramic; Price: 0.14
C28 = Capacitor: Manufacturer: TDK Corporation; Manufacturer Part Number: C2012X5R0J226K125AB; Tolerance: 10%; Voltage: 6.3V; Temperature Coefficient: X5R; Supplier: Digikey; Supplier Part Number: 445-7679-1-ND; Footprint: 0805; Component Type: Ceramic Capacitor; Price: .99
C29 = Capacitor: Manufacturer: Murata Electronics North America; Manufacturer Part Number: GRM21BR61E106MA73L; Tolerance: 10%; Voltage: 25V; Temperature Coefficient: X5R; Supplier: Digikey; Supplier Part Number: 490-10748-1-ND; Footprint: 0805; Component Type: Ceramic Capacitor; Price: .29
J1 J2 = 2way: ComponentLink1URL: http://www.edatools.cz/addons; ComponentLink1Description: Source; FootprintNote: LP=12mil, MP=40mil, HP=120mil
L1 = Inductor: FIXED IND 47UH 1.2A 200 MOHM SMD; Manufacturer: Wurth Electronics Inc.; Component Type: Inductor; Manufacturer Part Number: 74404064470; Price: 1.63; Supplier: Digi-Key; Supplier Part Number: 732-5556-1-ND; ESR: *; Saturation Current: *
L2 = Inductor: FIXED IND 2.2UH 3.15A 106 MOHM; Manufacturer: TDK Corporation; Manufacturer Part Number: VLS3012HBX-2R2M; Component Type: Inductor; Price: 1.49; Supplier: Digikey; Supplier Part Number: 445-175069-1-ND
R8 = Resistor: Manufacturer: Yageo; Manufacturer Part Number: RC0402FR-07174KL; Power Rating: 0.063W; Tolerance: 1%; Component Type: Resistor; Price: .14; Supplier: Digikey; Supplier Part Number: YAG3008CT-ND; Footprint: 0402
R9 = Resistor: RES SMD 14K OHM 1% 1/16W 0402; Manufacturer 1: Yageo; Manufacturer Part Number 1: RC0402FR-0714KL; Power Rating: 62.5mW; Voltage Rating: 50V; Max Power Dissipation: 63mW; Temperature Coefficient: 100ppm/°C; Supplier 1: Digi-Key; Supplier Part Number 1: 311-14.0KLRCT-ND; RoHS: Yes; Category: Chip SMD Resistors; Stock 1: 350826; Pricing 1: 1=0,10000, 10=0,01600, 100=0,00640, 1000=0,00286, 2500=0,00248, 5000=0,00205 (USD); Case/Package: 0402; Case Code (Metric): 1005; Case Code (Imperial): 0402; Contact Plating: Tin,Matte; Min Operating Temperature: -55°C; Max Operating Temperature: 155°C; Package Quantity: 1; Tolerance: 1%; Packaging: Tape and Reel; Resistor Type: Thick Film; Number of Terminations: 2; Termination: SMD/SMT; Voltage Rating (DC): 50V; Working Voltage: 50V; Features: Moisture Resistant; Series: RC; Technology: THICK FILM; Construction: Rectangular; Length: 1mm; Width: 0.02inch; Height: 0.016inch; Depth: 0.5mm; Military Standard: Not; Lead Free: Lead Free; RoHS Compliant: Yes; ComponentLink1URL: https://datasheet.ciiva.com/2453/pyu-r-int-thick-7-2453600.pdf?src-supplier=Digi-Key; ComponentLink1Description: https://datasheet.ciiva.com/2453/pyu-r-int-thick-7-2453600.pdf?src-supplier=Digi-Key; ComponentLink2URL: https://datasheet.ciiva.com/16869/pyu-rc0402-51-rohs-l-6-16869077.pdf?src-supplier=Avnet+Europe; ComponentLink2Description: https://datasheet.ciiva.com/16869/pyu-rc0402-51-rohs-l-6-16869077.pdf?src-supplier=Avnet+Europe; ComponentLink3URL: https://datasheet.ciiva.com/28404/pyu-rc0402-51-rohs-l-6-28404357.pdf?src-supplier=Avnet+Europe; ComponentLink3Description: https://datasheet.ciiva.com/28404/pyu-rc0402-51-rohs-l-6-28404357.pdf?src-supplier=Avnet+Europe; ComponentLink4URL: https://datasheet.ciiva.com/8890/pyu-rc0402-51-rohs-l-6-8890872.pdf?src-supplier=Avnet; ComponentLink4Description: https://datasheet.ciiva.com/8890/pyu-rc0402-51-rohs-l-6-8890872.pdf?src-supplier=Avnet; ComponentLink5URL: https://datasheet.ciiva.com/2453/pyu-r-int-thick-7-2453598.pdf?src-supplier=Digi-Key; ComponentLink5Description: https://datasheet.ciiva.com/2453/pyu-r-int-thick-7-2453598.pdf?src-supplier=Digi-Key; ComponentLink6URL: https://datasheet.ciiva.com/2453/pyu-r-int-thick-7-2453599.pdf?src-supplier=Digi-Key; ComponentLink6Description: https://datasheet.ciiva.com/2453/pyu-r-int-thick-7-2453599.pdf?src-supplier=Digi-Key
R10 = Resistor: Manufacturer: Yageo; Manufacturer Part Number: RT0402DRD0720KL; Power Rating: 0.063; Tolerance: ±0.5%; Component Type: Resistor; Price: .14; Supplier: Digikey; Supplier Part Number: 311-2157-1-ND; Footprint: 0402
R11 = Resistor: Manufacturer: Yageo; Manufacturer Part Number: RC0402FR-07100KL; Power Rating: 0.063; Tolerance: 1%; Component Type: Resistor; Price: .15; Supplier: Digikey; Supplier Part Number: 311-100KLRCT-ND; Footprint: 0402
U3 = MAX17502G: 60V, 1A, Ultra-Small, High-Efficiency,  Synchronous Step-Down DC-DC Converter; Manufacturer: Maxim Integrated; Manufacturer Part Number: MAX17502GATB+T; Supplier 1: Digi-Key; Supplier Part Number 1: MAX17502GATB+TCT-ND; Component Type: Synchronous Step-Down DC-DC Converter; Supplier: Digi-Key; Supplier Part Number: MAX17502GATB+TCT-ND
U4 = MIC5501_SOT23-5: MIC5504_SOT23-5; Manufacturer: Microchip Technology; Manufacturer Part Number: MIC5504-3.3YM5-TR; Footprint: SOT-23-5; Price: 0.16; Supplier: Digi-Key; Supplier Part Number: 576-4764-1-ND; Component Type: IC REG LINEAR 3.3V 300MA SOT23-5
U5 = TPS62163DSGR: Buck Step Down Regulator with 3 to 17 V Input and 5 V Output, -40 to 85 degC, 8-Pin WSON (DSG), Green (RoHS & no Sb/Br); Manufacturer: Texas Instruments; Duty Cycle(Max)(%): 100; Iout(Max)(A): 1; Iq(Typ)(mA): 0.017; Preset Vout(V): 5; Rating: Catalog; SubFamily: Step-Down Regulator; Switch Current Limit(Typ)(A): 1.8; Synchronous Rectification: TRUE; Vin(Max)(V): 17; Vin(Min)(V): 3; DatasheetVersion: SLVSAM2A; PackageVersion: revB, Oct-2010; PackageReference: DSG8-1600X900TP; PackageDescription: 8-Pin Plastic Small Outline No-Lead, 2 x 2 x 0.8 mm Body, 0.5 mm Pitch, Exposed Pad; Supplier 1: Digi-Key; Supplier Part Number 1: 296-29898-2-ND; Supplier 2: Digi-Key; Supplier Part Number 2: 296-29898-1-ND; Supplier 3: Digi-Key; Supplier Part Number 3: 296-29898-6-ND; Supplier 4: Newark; Supplier Part Number 4: 74T5559; Supplier 5: Mouser; Supplier Part Number 5: 595-TPS62163DSGR; Eco-Plan: Green (RoHS & no Sb/Br); Regulated Outputs(#): 1; Topology: Buck; Vout(Max)(V): 5; Vout(Min)(V): 5; Mounting Technology: Surface Mount; Code_JEDEC: MO-229; PartNumber: TPS62163DSGR; ComponentLink1Description: Datasheet; ComponentLink1URL: http://www.ti.com/general/docs/lit/getliterature.tsp?genericPartNumber=TPS62163&fileType=pdf; ComponentLink2Description: Package Specification; ComponentLink2URL: http://www.ti.com/litv/pdf/mpds308a; ComponentLink3Description: URL Link1; ComponentLink3URL: Samples URL:http://www.ti.com/product/tps62163#samples; Component Type: Buck Step Down Regulator; Manufacturer Part Number: TPS62163DSGR; Supplier: Digi-Key; Supplier Part Number: 296-29898-1-ND

## Sheet Connectors.SchDoc
size A4
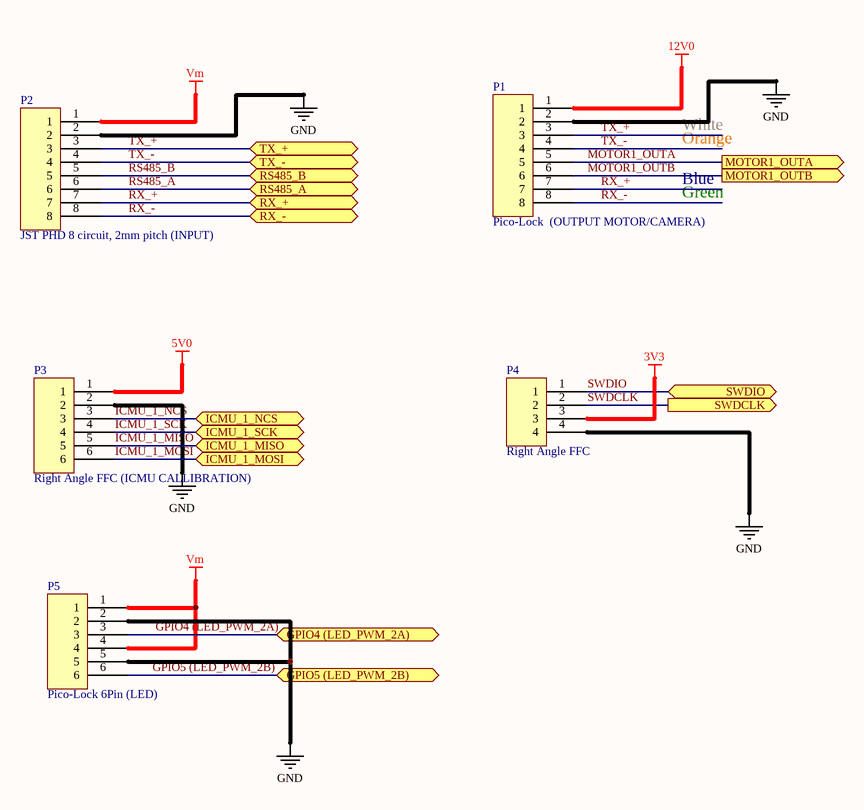
[diagram p5: Connectors.SchDoc]

### Parts
P1  Pico-Lock  (OUTPUT MOTOR/CAMERA)  [5040500891]
P2  JST PHD 8 circuit, 2mm pitch (INPUT)  [JST PHD connector]
P3  Right Angle FFC (ICMU CALLIBRATION)  [XF2W_0615_1A]
P4  Right Angle FFC  [XF2W_0415_1A]
P5  Pico-Lock 6Pin (LED)  [5040500691]

### Ports
GPIO4 (LED_PWM_2A) (bidir), GPIO5 (LED_PWM_2B) (bidir), ICMU_1_MISO (bidir), ICMU_1_MOSI (bidir), ICMU_1_NCS (bidir), ICMU_1_SCK (bidir), MOTOR1_OUTA (out), MOTOR1_OUTB (out), RS485_A (bidir), RS485_B (bidir), RX_+ (bidir), RX_- (bidir), SWDCLK (out), SWDIO (bidir), TX_+ (bidir), TX_- (bidir)

### Nets
3V3: P4.3
5V0: P3.1
12V0: P1.1
GND: P1.2 P2.2 P3.2 P4.4 P5.2 P5.5
Vm: P2.1 P5.1 P5.4
GPIO4 (LED_PWM_2A): P5.3 ; port GPIO4 (LED_PWM_2A)
GPIO5 (LED_PWM_2B): P5.6 ; port GPIO5 (LED_PWM_2B)
ICMU_1_MISO: P3.5 ; port ICMU_1_MISO
ICMU_1_MOSI: P3.6 ; port ICMU_1_MOSI
ICMU_1_NCS: P3.3 ; port ICMU_1_NCS
ICMU_1_SCK: P3.4 ; port ICMU_1_SCK
MOTOR1_OUTA: P1.5 ; port MOTOR1_OUTA
MOTOR1_OUTB: P1.6 ; port MOTOR1_OUTB
RS485_A: P2.6 ; port RS485_A
RS485_B: P2.5 ; port RS485_B
RX_+: P1.7 P2.7 ; port RX_+
RX_-: P1.8 P2.8 ; port RX_-
SWDCLK: P4.2 ; port SWDCLK
SWDIO: P4.1 ; port SWDIO
TX_+: P1.3 P2.3 ; port TX_+
TX_-: P1.4 P2.4 ; port TX_-

### Notes on the sheet
- Orange
- White
- Blue
- Green

### Library data of the parts
P1 = 5040500891: Pico-Lock 8 circuit, 1.5mm pitch; Manufacturer: Molex, LLC; Component Type: 8 Positions Header, Shrouded Connector 0.059" (1.50mm) Surface Mount, Right Angle Gold; Manufacturer Part Number: 5040500891; Price: 2.37; Supplier: Digi-Key; Supplier Part Number: WM14421CT-ND
P2 = S8B-PHDSS: JST PHD 8 circuit, 2mm pitch; Manufacturer Part Number: S8B-PHDSS(LF)(SN); Component Type: CONN HEADER PHD SIDE 8POS 2MM; Manufacturer: JST; Price: .63; Supplier: Digi-Key; Supplier Part Number: 455-2256-ND
P3 = XF2W-0615-1A: 6 pin FFC connector,0.5mm pitch, 0.5A; Manufacturer: Omron Electronics Inc-EMC Div; Component Type: 6 Position FPC Connector Contacts, Top and Bottom 0.020" (0.50mm) Surface Mount, Right Angle; Manufacturer Part Number: XF2W-0615-1A; Price: 1.41; Supplier: Digi-Key; Supplier Part Number: OR1190CT-ND
P4 = XF2W-0415-1A: 4 pin FFC connector,0.5mm pitch, 0.5A; Manufacturer: Omron Electronics Inc-EMC Div; Component Type: 4 Position FPC Connector Contacts, Top and Bottom 0.020" (0.50mm) Surface Mount, Right Angle; Manufacturer Part Number: XF2W-0415-1A; Supplier: Digi-Key; Supplier Part Number: OR1148CT-ND
P5 = 5040500691: Pico-Lock 5 circuit, 1.5mm pitch; Manufacturer: Molex, LLC; Component Type: 6 Positions Header, Shrouded Connector 0.059" (1.50mm) Surface Mount, Right Angle Gold; Manufacturer Part Number: 5040500691; Price: 2.06; Supplier: Digi-Key; Supplier Part Number: WM10143CT-ND

## Nets that join several sheets
3V3: STM32F405RGT6 (14 pins), RS485 (5 pins), MotorDriverDRV8313_1 (6 pins), VoltageRegulators (C26.1 U4.5), Connectors (P4.3)
5V0: Encoder_ICMU150 (8 pins), VoltageRegulators (7 pins), Connectors (P3.1)
12V0: VoltageRegulators (6 pins), Connectors (P1.1)
GND: STM32F405RGT6 (18 pins), RS485 (C33.2 R15.1 U8.5 U8.9), MotorDriverDRV8313_1 (22 pins), Encoder_ICMU150 (8 pins), VoltageRegulators (18 pins), Connectors (6 pins)
Vm: STM32F405RGT6 (R1.2), MotorDriverDRV8313_1 (7 pins), VoltageRegulators (C20.1 U3.2 U3.3), Connectors (P2.1 P5.1 P5.4)
AD8418_1_SENSE1: STM32F405RGT6 (U1.8), MotorDriverDRV8313_1 (C35.1 R2.2)
DRV8313_1_EN1: STM32F405RGT6 (U1.59), MotorDriverDRV8313_1 (U2.1)
DRV8313_1_EN2: STM32F405RGT6 (U1.28), MotorDriverDRV8313_1 (U2.35)
DRV8313_1_FAULT: STM32F405RGT6 (U1.30), MotorDriverDRV8313_1 (R5.2 U2.28)
DRV8313_1_IN1: STM32F405RGT6 (U1.41), MotorDriverDRV8313_1 (U2.2)
DRV8313_1_IN2: STM32F405RGT6 (U1.42), MotorDriverDRV8313_1 (U2.36)
DRV8313_1_RESET: STM32F405RGT6 (U1.54), MotorDriverDRV8313_1 (R6.2 U2.26)
GPIO4 (LED_PWM_2A): STM32F405RGT6 (U1.39), Connectors (P5.3)
GPIO5 (LED_PWM_2B): STM32F405RGT6 (U1.40), Connectors (P5.6)
ICMU_1_MISO: STM32F405RGT6 (U1.56), Encoder_ICMU150 (U6.9), Connectors (P3.5)
ICMU_1_MOSI: STM32F405RGT6 (U1.57), Encoder_ICMU150 (U6.10), Connectors (P3.6)
ICMU_1_NCS: STM32F405RGT6 (U1.50), Encoder_ICMU150 (U6.12), Connectors (P3.3)
ICMU_1_SCK: STM32F405RGT6 (U1.55), Encoder_ICMU150 (U6.11), Connectors (P3.4)
MOTOR1_OUTA: MotorDriverDRV8313_1 (R19.2 U9.1), Connectors (P1.5)
MOTOR1_OUTB: MotorDriverDRV8313_1 (U2.13), Connectors (P1.6)
RS485_A: RS485 (R14.2 U8.6), Connectors (P2.6)
RS485_B: RS485 (R14.1 U8.7), Connectors (P2.5)
SWDCLK: STM32F405RGT6 (U1.49), Connectors (P4.2)
SWDIO: STM32F405RGT6 (U1.46), Connectors (P4.1)
TTL_RX1: STM32F405RGT6 (U1.52), RS485 (R17.1 U8.1)
TTL_RXE: STM32F405RGT6 (U1.37), RS485 (U8.2)
TTL_TX1: STM32F405RGT6 (U1.51), RS485 (R16.1 U8.4)
TTL_TXE: STM32F405RGT6 (U1.38), RS485 (U8.3)